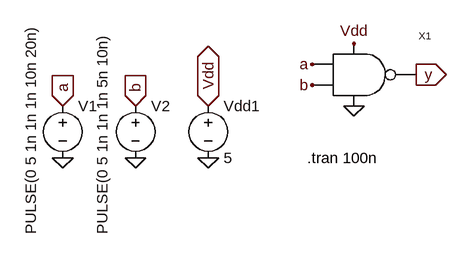
[diagram p0: schematic nandsim.asc]
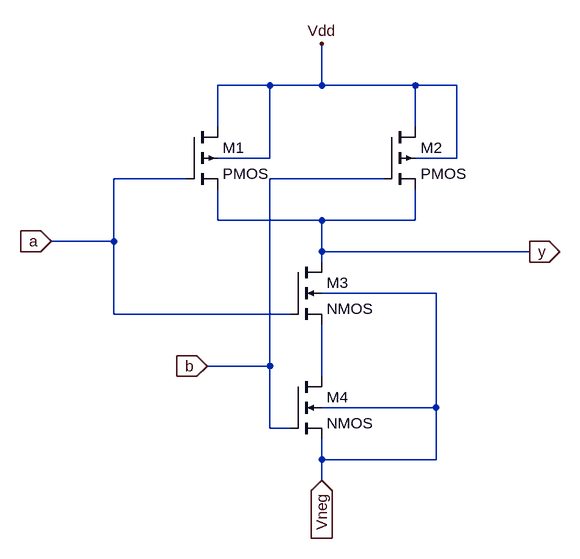
[diagram p1: sub-circuit nandsymb.asc]
nandsim.asc, the LTspice schematic file:
Version 4
SHEET 1 880 680
FLAG 112 400 0
FLAG 224 400 0
FLAG 336 400 0
FLAG 112 320 a
IOPIN 112 320 In
FLAG 224 320 b
IOPIN 224 320 In
FLAG 336 320 Vdd
IOPIN 336 320 BiDir
FLAG 496 256 a
FLAG 496 288 b
FLAG 560 224 Vdd
FLAG 560 320 0
FLAG 656 272 y
IOPIN 656 272 Out
SYMBOL Voltage 112 304 R0
WINDOW 3 -49 -110 VRight 2
SYMATTR Value PULSE(0 5 1n 1n 1n 10n 20n)
SYMATTR InstName V1
SYMBOL Voltage 224 304 R0
WINDOW 3 -51 -96 VRight 2
SYMATTR Value PULSE(0 5 1n 1n 1n 5n 10n)
SYMATTR InstName V2
SYMBOL Voltage 336 304 R0
SYMATTR InstName Vdd1
SYMATTR Value 5
SYMBOL nandsymb 592 272 R0
SYMATTR InstName X1
TEXT 488 400 Left 2 !.tran 100n

nandsymb.asc, the sub-circuit schematic file:
Version 4
SHEET 1 972 712
WIRE 512 0 432 0
WIRE 592 0 592 -64
WIRE 592 0 512 0
WIRE 736 0 592 0
WIRE 800 0 736 0
WIRE 432 64 432 0
WIRE 736 64 736 0
WIRE 512 112 512 0
WIRE 512 112 432 112
WIRE 800 112 800 0
WIRE 800 112 736 112
WIRE 384 144 272 144
WIRE 688 144 512 144
WIRE 432 208 432 160
WIRE 592 208 432 208
WIRE 736 208 736 160
WIRE 736 208 592 208
WIRE 272 240 272 144
WIRE 272 240 176 240
WIRE 592 256 592 208
WIRE 912 256 592 256
WIRE 592 272 592 256
WIRE 768 320 592 320
WIRE 272 352 272 240
WIRE 544 352 272 352
WIRE 512 432 512 144
WIRE 512 432 416 432
WIRE 592 448 592 368
WIRE 768 496 768 320
WIRE 768 496 592 496
WIRE 512 528 512 432
WIRE 544 528 512 528
WIRE 592 576 592 544
WIRE 768 576 768 496
WIRE 768 576 592 576
WIRE 592 608 592 576
FLAG 592 -64 Vdd
FLAG 912 256 y
IOPIN 912 256 Out
FLAG 176 240 a
IOPIN 176 240 In
FLAG 416 432 b
IOPIN 416 432 In
FLAG 592 608 Vneg
IOPIN 592 608 In
SYMBOL pmos4 384 64 R0
SYMATTR InstName M1
SYMBOL pmos4 688 64 R0
SYMATTR InstName M2
SYMBOL nmos4 544 272 R0
SYMATTR InstName M3
SYMBOL nmos4 544 448 R0
SYMATTR InstName M4

The netlist it stands for:
* nandsim.asc
V1 a 0 PULSE(0 5 1n 1n 1n 10n 20n)
V2 b 0 PULSE(0 5 1n 1n 1n 5n 10n)
Vdd1 Vdd 0 5
XX1 a b y Vdd 0 nandsymb

* block symbol definitions
.subckt nandsymb a b y Vdd Vneg
M1 Vdd a y Vdd PMOS
M2 Vdd b y Vdd PMOS
M3 y a N001 Vneg NMOS
M4 N001 b Vneg Vneg NMOS
.ends nandsymb

.model NMOS NMOS
.model PMOS PMOS
.lib standard.mos
.tran 100n
.backanno
.end